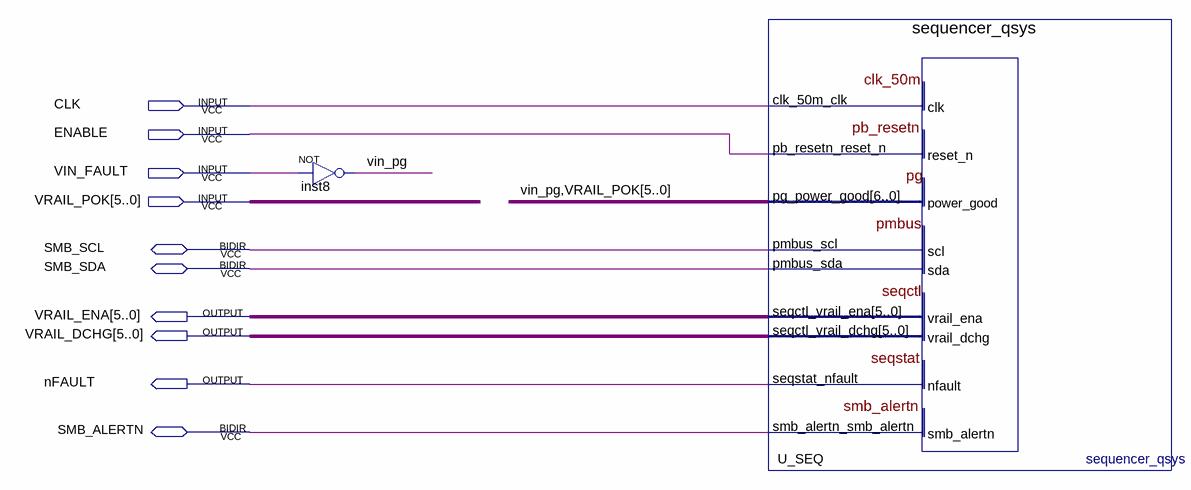
[diagram p0: schematic sheet]
// Quartus schematic sequencer.bdf as structural Verilog: 2 symbols, 10 pins
module sequencer (
  input  CLK,
  input  ENABLE,
  input  VIN_FAULT,
  input  [5:0] VRAIL_POK,
  inout  SMB_SCL,
  inout  SMB_SDA,
  inout  SMB_ALERTN,
  output [5:0] VRAIL_ENA,
  output [5:0] VRAIL_DCHG,
  output nFAULT
);

  wire vin_pg;

  not inst8 (vin_pg, VIN_FAULT);
  sequencer_qsys U_SEQ (
    .clk_50m_clk(CLK), .pb_resetn_reset_n(ENABLE), .pg_power_good({vin_pg, VRAIL_POK}), .pmbus_scl(SMB_SCL),
    .seqctl_vrail_ena(VRAIL_ENA), .seqctl_vrail_dchg(VRAIL_DCHG), .seqstat_nfault(nFAULT),
    .smb_alertn_smb_alertn(SMB_ALERTN), .pmbus_sda(SMB_SDA));
endmodule
